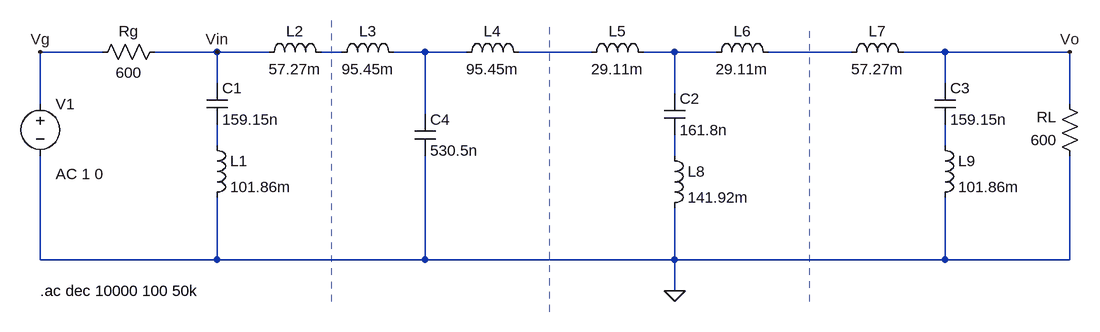
[diagram p0: schematic ej7.asc]
ej7.asc, the LTspice schematic file:
Version 4
SHEET 1 1632 680
WIRE 112 48 16 48
WIRE 288 48 192 48
WIRE 368 48 288 48
WIRE 480 48 448 48
WIRE 608 48 560 48
WIRE 672 48 608 48
WIRE 864 48 752 48
WIRE 992 48 944 48
WIRE 1056 48 992 48
WIRE 1264 48 1136 48
WIRE 1408 48 1344 48
WIRE 1600 48 1408 48
WIRE 288 96 288 48
WIRE 1408 96 1408 48
WIRE 992 112 992 48
WIRE 16 128 16 48
WIRE 1600 128 1600 48
WIRE 608 144 608 48
WIRE 288 192 288 160
WIRE 1408 192 1408 160
WIRE 992 208 992 176
WIRE 16 368 16 208
WIRE 288 368 288 272
WIRE 288 368 16 368
WIRE 608 368 608 208
WIRE 608 368 288 368
WIRE 992 368 992 288
WIRE 992 368 608 368
WIRE 1408 368 1408 272
WIRE 1408 368 992 368
WIRE 1600 368 1600 208
WIRE 1600 368 1408 368
WIRE 992 416 992 368
FLAG 992 416 0
FLAG 1600 48 Vo
FLAG 16 48 Vg
FLAG 288 48 Vin
SYMBOL voltage 16 112 R0
WINDOW 123 24 124 Left 2
WINDOW 39 0 0 Left 0
SYMATTR InstName V1
SYMATTR Value ""
SYMATTR Value2 AC 1 0
SYMBOL res 208 32 R90
WINDOW 0 0 56 VBottom 2
WINDOW 3 32 56 VTop 2
SYMATTR InstName Rg
SYMATTR Value 600
SYMBOL res 1616 224 R180
WINDOW 0 36 76 Left 2
WINDOW 3 36 40 Left 2
SYMATTR InstName RL
SYMATTR Value 600
SYMBOL cap 272 96 R0
SYMATTR InstName C1
SYMATTR Value 159.15n
SYMBOL ind 272 176 R0
SYMATTR InstName L1
SYMATTR Value 101.86m
SYMBOL ind 352 64 R270
WINDOW 0 32 56 VTop 2
WINDOW 3 5 56 VBottom 2
SYMATTR InstName L2
SYMATTR Value 57.27m
SYMBOL ind 464 64 R270
WINDOW 0 32 56 VTop 2
WINDOW 3 5 56 VBottom 2
SYMATTR InstName L3
SYMATTR Value 95.45m
SYMBOL ind 656 64 R270
WINDOW 0 32 56 VTop 2
WINDOW 3 5 56 VBottom 2
SYMATTR InstName L4
SYMATTR Value 95.45m
SYMBOL ind 848 64 R270
WINDOW 0 32 56 VTop 2
WINDOW 3 5 56 VBottom 2
SYMATTR InstName L5
SYMATTR Value 29.11m
SYMBOL ind 1040 64 R270
WINDOW 0 32 56 VTop 2
WINDOW 3 5 56 VBottom 2
SYMATTR InstName L6
SYMATTR Value 29.11m
SYMBOL ind 1248 64 R270
WINDOW 0 32 56 VTop 2
WINDOW 3 5 56 VBottom 2
SYMATTR InstName L7
SYMATTR Value 57.27m
SYMBOL ind 976 192 R0
SYMATTR InstName L8
SYMATTR Value 141.92m
SYMBOL ind 1392 176 R0
SYMATTR InstName L9
SYMATTR Value 101.86m
SYMBOL cap 976 112 R0
SYMATTR InstName C2
SYMATTR Value 161.8n
SYMBOL cap 1392 96 R0
SYMATTR InstName C3
SYMATTR Value 159.15n
SYMBOL cap 592 144 R0
SYMATTR InstName C4
SYMATTR Value 530.5n
TEXT 16 416 Left 2 !.ac dec 10000 100 50k
LINE Normal 464 432 464 0 2
LINE Normal 800 448 800 0 2
LINE Normal 1200 432 1200 16 2

The netlist it stands for:
* ej7.asc
V1 Vg 0 AC 1 0
Rg Vin Vg 600
RL 0 Vo 600
C1 Vin N006 159.15n
L1 N006 0 101.86m
L2 Vin N001 57.27m
L3 N001 N002 95.45m
L4 N002 N003 95.45m
L5 N003 N004 29.11m
L6 N004 N005 29.11m
L7 N005 Vo 57.27m
L8 N008 0 141.92m
L9 N007 0 101.86m
C2 N004 N008 161.8n
C3 Vo N007 159.15n
C4 N002 0 530.5n
.ac dec 10000 100 50k
.backanno
.end